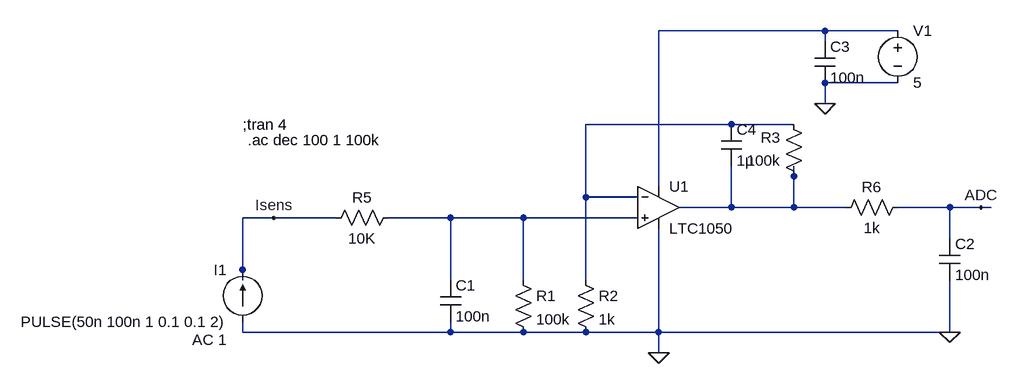
[diagram p0: schematic Circuit Capteur complet.asc]
Circuit Capteur complet.asc, the LTspice schematic file:
Version 4
SHEET 1 1272 680
WIRE 992 -256 736 -256
WIRE 1104 -256 992 -256
WIRE 992 -240 992 -256
WIRE 1104 -176 992 -176
WIRE 992 -144 992 -176
WIRE 848 -112 624 -112
WIRE 944 -112 848 -112
WIRE 944 -32 944 -48
WIRE 736 -16 736 -256
WIRE 624 0 624 -112
WIRE 704 0 624 0
WIRE 848 16 848 -48
WIRE 848 16 768 16
WIRE 944 16 944 -32
WIRE 944 16 848 16
WIRE 1024 16 944 16
WIRE 1184 16 1104 16
WIRE 1232 16 1184 16
WIRE 1248 16 1232 16
WIRE 144 32 96 32
WIRE 240 32 144 32
WIRE 416 32 320 32
WIRE 528 32 416 32
WIRE 704 32 528 32
WIRE 1184 64 1184 16
WIRE 96 112 96 32
WIRE 96 128 96 112
WIRE 416 128 416 32
WIRE 528 128 528 32
WIRE 624 128 624 0
WIRE 96 208 96 192
WIRE 416 208 416 192
WIRE 416 208 96 208
WIRE 528 208 416 208
WIRE 624 208 528 208
WIRE 736 208 736 48
WIRE 736 208 624 208
WIRE 1184 208 1184 128
WIRE 1184 208 736 208
WIRE 736 240 736 208
FLAG 736 240 0
FLAG 992 -144 0
FLAG 1184 208 0
FLAG 1232 16 ADC
FLAG 144 32 Isens
SYMBOL current 96 192 R180
WINDOW 0 24 80 Left 2
WINDOW 3 24 0 Left 2
WINDOW 123 24 -28 Left 2
WINDOW 39 0 0 Left 0
SYMATTR InstName I1
SYMATTR Value PULSE(50n 100n 1 0.1 0.1 2)
SYMATTR Value2 AC 1
SYMBOL res 336 16 R90
WINDOW 0 0 56 VBottom 2
WINDOW 3 32 56 VTop 2
SYMATTR InstName R5
SYMATTR Value 10K
SYMATTR SpiceLine tol=1 pwr=0.1
SYMBOL cap 400 128 R0
SYMATTR InstName C1
SYMATTR Value 100n
SYMBOL res 512 112 R0
SYMATTR InstName R1
SYMATTR Value 100k
SYMBOL res 608 112 R0
SYMATTR InstName R2
SYMATTR Value 1k
SYMBOL OpAmps\\LTC1050 736 -48 R0
SYMATTR InstName U1
SYMBOL res 1120 0 R90
WINDOW 0 0 56 VBottom 2
WINDOW 3 32 56 VTop 2
SYMATTR InstName R6
SYMATTR Value 1k
SYMBOL res 960 -16 R180
WINDOW 0 36 76 Left 2
WINDOW 3 36 40 Left 2
SYMATTR InstName R3
SYMATTR Value 100k
SYMBOL cap 832 -112 R0
SYMATTR InstName C4
SYMATTR Value 1µ
SYMBOL cap 1168 64 R0
SYMATTR InstName C2
SYMATTR Value 100n
SYMBOL cap 976 -240 R0
SYMATTR InstName C3
SYMATTR Value 100n
SYMBOL voltage 1104 -272 R0
WINDOW 123 0 0 Left 0
WINDOW 39 0 0 Left 0
SYMATTR InstName V1
SYMATTR Value 5
TEXT 96 -112 Left 2 !;tran 4
TEXT 104 -88 Left 2 !.ac dec 100 1 100k

The netlist it stands for:
* Circuit Capteur complet.asc
I1 0 Isens PULSE(50n 100n 1 0.1 0.1 2) AC 1
R5 N004 Isens 10K tol=1 pwr=0.1
C1 N004 0 100n
R1 N004 0 100k
R2 N002 0 1k
XU1 N004 N002 N001 0 N003 LTC1050  ; pins In+ In- V+ V- OUT
R6 ADC N003 1k
R3 N003 N002 100k
C4 N002 N003 1µ
C2 ADC 0 100n
C3 N001 0 100n
V1 N001 0 5
;tran 4
.ac dec 100 1 100k
.lib LTC.lib
.backanno
.end